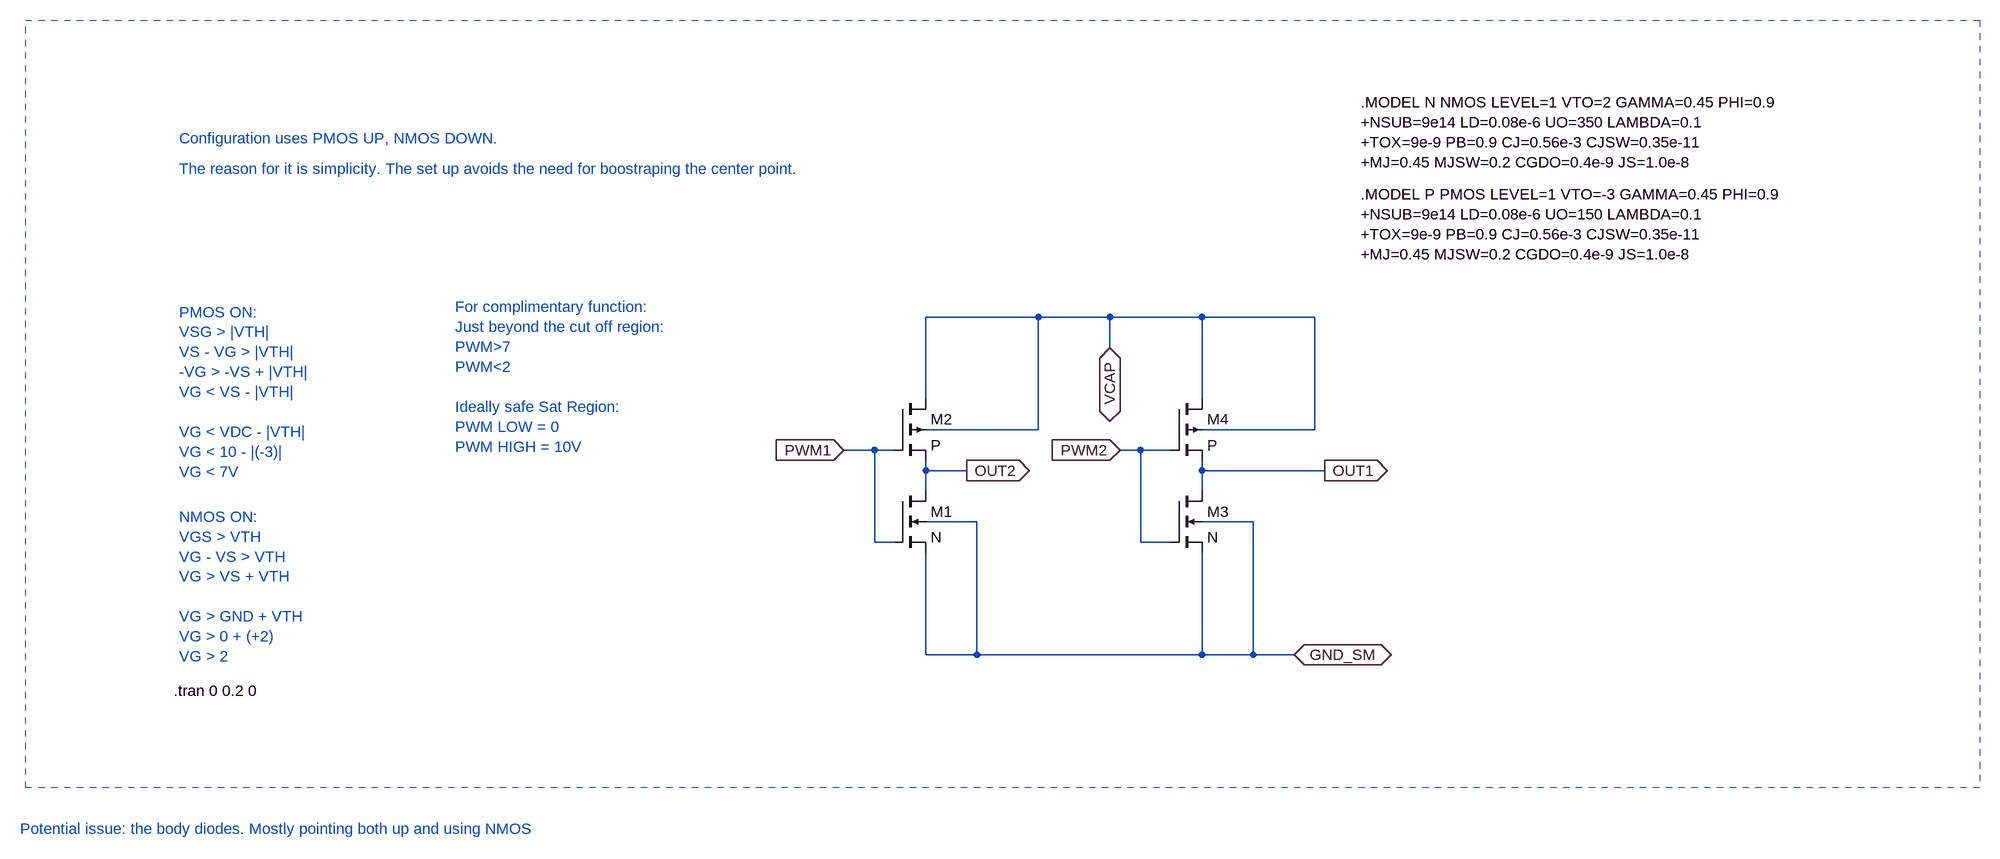
[diagram p0: schematic H-Bridge-only.asc]
H-Bridge-only.asc, the LTspice schematic file:
Version 4.1
SHEET 1 3540 848
WIRE 1904 32 1728 32
WIRE 2016 32 1904 32
WIRE 2160 32 2016 32
WIRE 2336 32 2160 32
WIRE 2016 80 2016 32
WIRE 1728 160 1728 32
WIRE 2160 160 2160 32
WIRE 1904 208 1904 32
WIRE 1904 208 1728 208
WIRE 2336 208 2336 32
WIRE 2336 208 2160 208
WIRE 1648 240 1600 240
WIRE 1680 240 1648 240
WIRE 2064 240 2032 240
WIRE 2112 240 2064 240
WIRE 1728 272 1728 256
WIRE 1792 272 1728 272
WIRE 2160 272 2160 256
WIRE 2352 272 2160 272
WIRE 1728 304 1728 272
WIRE 2160 304 2160 272
WIRE 1808 352 1728 352
WIRE 2240 352 2160 352
WIRE 1648 384 1648 240
WIRE 1680 384 1648 384
WIRE 2064 384 2064 240
WIRE 2112 384 2064 384
WIRE 1728 560 1728 400
WIRE 1808 560 1808 352
WIRE 1808 560 1728 560
WIRE 2160 560 2160 400
WIRE 2160 560 1808 560
WIRE 2240 560 2240 352
WIRE 2240 560 2160 560
WIRE 2304 560 2240 560
FLAG 1600 240 PWM1
IOPIN 1600 240 In
FLAG 2032 240 PWM2
IOPIN 2032 240 In
FLAG 1792 272 OUT2
IOPIN 1792 272 Out
FLAG 2352 272 OUT1
IOPIN 2352 272 Out
FLAG 2016 80 VCAP
IOPIN 2016 80 BiDir
FLAG 2304 560 GND_SM
IOPIN 2304 560 BiDir
SYMBOL nmos4 1680 304 R0
SYMATTR InstName M1
SYMATTR Value N
SYMBOL pmos4 1680 160 R0
SYMATTR InstName M2
SYMATTR Value P
SYMBOL nmos4 2112 304 R0
SYMATTR InstName M3
SYMATTR Value N
SYMBOL pmos4 2112 160 R0
SYMATTR InstName M4
SYMATTR Value P
TEXT 2408 -304 Left 2 !.MODEL N NMOS LEVEL=1 VTO=2 GAMMA=0.45 PHI=0.9\n+NSUB=9e14 LD=0.08e-6 UO=350 LAMBDA=0.1\n+TOX=9e-9 PB=0.9 CJ=0.56e-3 CJSW=0.35e-11\n+MJ=0.45 MJSW=0.2 CGDO=0.4e-9 JS=1.0e-8
TEXT 2408 -160 Left 2 !.MODEL P PMOS LEVEL=1 VTO=-3 GAMMA=0.45 PHI=0.9\n+NSUB=9e14 LD=0.08e-6 UO=150 LAMBDA=0.1\n+TOX=9e-9 PB=0.9 CJ=0.56e-3 CJSW=0.35e-11\n+MJ=0.45 MJSW=0.2 CGDO=0.4e-9 JS=1.0e-8
TEXT 560 -248 Left 2 ;Configuration uses PMOS UP, NMOS DOWN.
TEXT 560 -200 Left 2 ;The reason for it is simplicity. The set up avoids the need for boostraping the center point.
TEXT 560 24 Left 2 ;PMOS ON: \nVSG > |VTH| \nVS - VG > |VTH| \n-VG > -VS + |VTH| \nVG < VS - |VTH| \n \nVG < VDC - |VTH| \nVG < 10 - |(-3)|\nVG < 7V
TEXT 560 344 Left 2 ;NMOS ON:\nVGS > VTH\nVG - VS > VTH \nVG > VS + VTH\n \nVG > GND + VTH \nVG > 0 + (+2) \nVG > 2
TEXT 992 16 Left 2 ;For complimentary function: \nJust beyond the cut off region: \nPWM>7 \nPWM<2\n \nIdeally safe Sat Region: \nPWM LOW = 0\nPWM HIGH = 10V
TEXT 552 616 Left 2 !.tran 0 0.2 0
TEXT 312 832 Left 2 ;Potential issue: the body diodes. Mostly pointing both up and using NMOS
RECTANGLE Normal 3376 768 320 -432 2

The netlist it stands for:
* H-Bridge-only.asc
M1 OUT2 PWM1 GND_SM GND_SM N
M2 VCAP PWM1 OUT2 VCAP P
M3 OUT1 PWM2 GND_SM GND_SM N
M4 VCAP PWM2 OUT1 VCAP P
.model NMOS NMOS
.model PMOS PMOS
.lib standard.mos
.MODEL N NMOS LEVEL=1 VTO=2 GAMMA=0.45 PHI=0.9
+NSUB=9e14 LD=0.08e-6 UO=350 LAMBDA=0.1
+TOX=9e-9 PB=0.9 CJ=0.56e-3 CJSW=0.35e-11
+MJ=0.45 MJSW=0.2 CGDO=0.4e-9 JS=1.0e-8
.MODEL P PMOS LEVEL=1 VTO=-3 GAMMA=0.45 PHI=0.9
+NSUB=9e14 LD=0.08e-6 UO=150 LAMBDA=0.1
+TOX=9e-9 PB=0.9 CJ=0.56e-3 CJSW=0.35e-11
+MJ=0.45 MJSW=0.2 CGDO=0.4e-9 JS=1.0e-8
* Configuration uses PMOS UP, NMOS DOWN.
* The reason for it is simplicity. The set up avoids the need for boostraping the center point.
* PMOS ON:
* VSG > |VTH|
* VS - VG > |VTH|
* -VG > -VS + |VTH|
* VG < VS - |VTH|
* VG < VDC - |VTH|
* VG < 10 - |(-3)|
* VG < 7V
* NMOS ON:
* VGS > VTH
* VG - VS > VTH
* VG > VS + VTH
* VG > GND + VTH
* VG > 0 + (+2)
* VG > 2
* For complimentary function:
* Just beyond the cut off region:
* PWM>7
* PWM<2
* Ideally safe Sat Region:
* PWM LOW = 0
* PWM HIGH = 10V
.tran 0 0.2 0
* Potential issue: the body diodes. Mostly pointing both up and using NMOS
.backanno
.end